# EAGLE design ATESLEME (EAGLE 9.6.2)

## Sheet 1 of 5
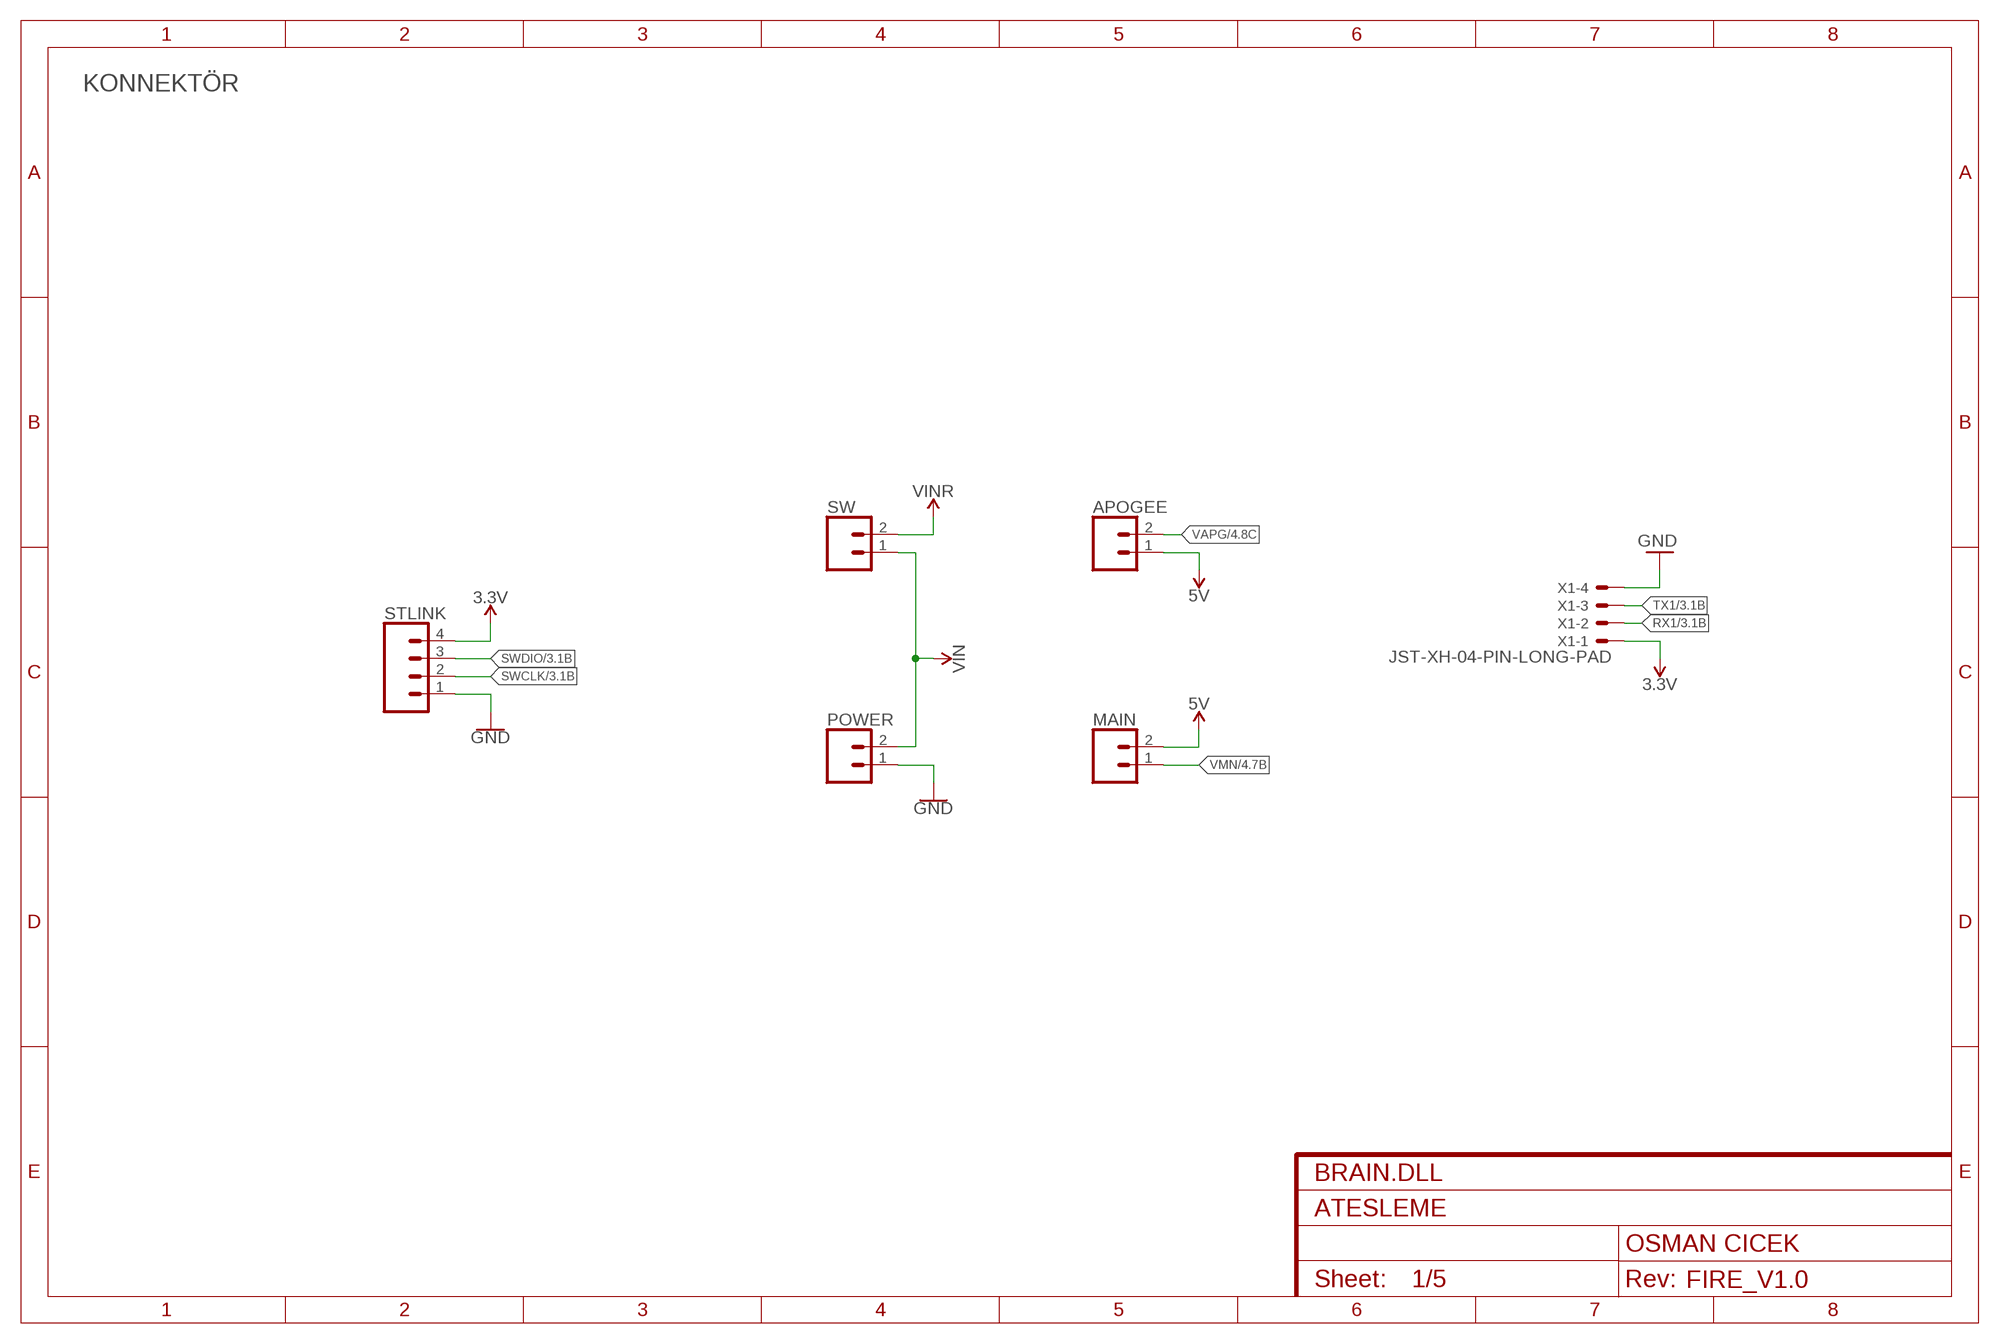
[diagram p0: schematic, sheet 1]
FRAME1 (FRAME-A4L): ATESLEME: PART1; CNAME: BRAIN.DLL; CREVISION: FIRE_V1.0; DESIGNER: OSMAN CICEK

### Parts
APOGEE  CONN_023.5MM-NO_SILK  [SCREWTERMINAL-3.5MM-2-NS]
MAIN  CONN_023.5MM-NO_SILK  [SCREWTERMINAL-3.5MM-2-NS]
POWER  CONN_023.5MM-NO_SILK  [SCREWTERMINAL-3.5MM-2-NS]
STLINK  CONN_04  [1X04]
SW  CONN_023.5MM-NO_SILK  [SCREWTERMINAL-3.5MM-2-NS]
X1  JST-XH-04-PIN-LONG-PAD  [JST-XH-04-PACKAGE-LONG-PAD]

### Nets
3.3V: STLINK.4 X1.1 ; also sheet 2,3,5
5V: APOGEE.1 MAIN.2 ; also sheet 2
GND: POWER.1 STLINK.1 X1.4 ; also sheet 2,3,4,5
RX1: X1.2 ; also sheet 3
SWCLK: STLINK.2 ; also sheet 3
SWDIO: STLINK.3 ; also sheet 3
TX1: X1.3 ; also sheet 3
VAPG: APOGEE.2 ; also sheet 4
VCC: POWER.2 SW.1 ; supply symbol labelled VIN
VIN: SW.2 ; supply symbol labelled VINR ; also sheet 2
VMN: MAIN.1 ; also sheet 4

### Notes on the sheet
- KONNEKTÖR

## Sheet 2 of 5
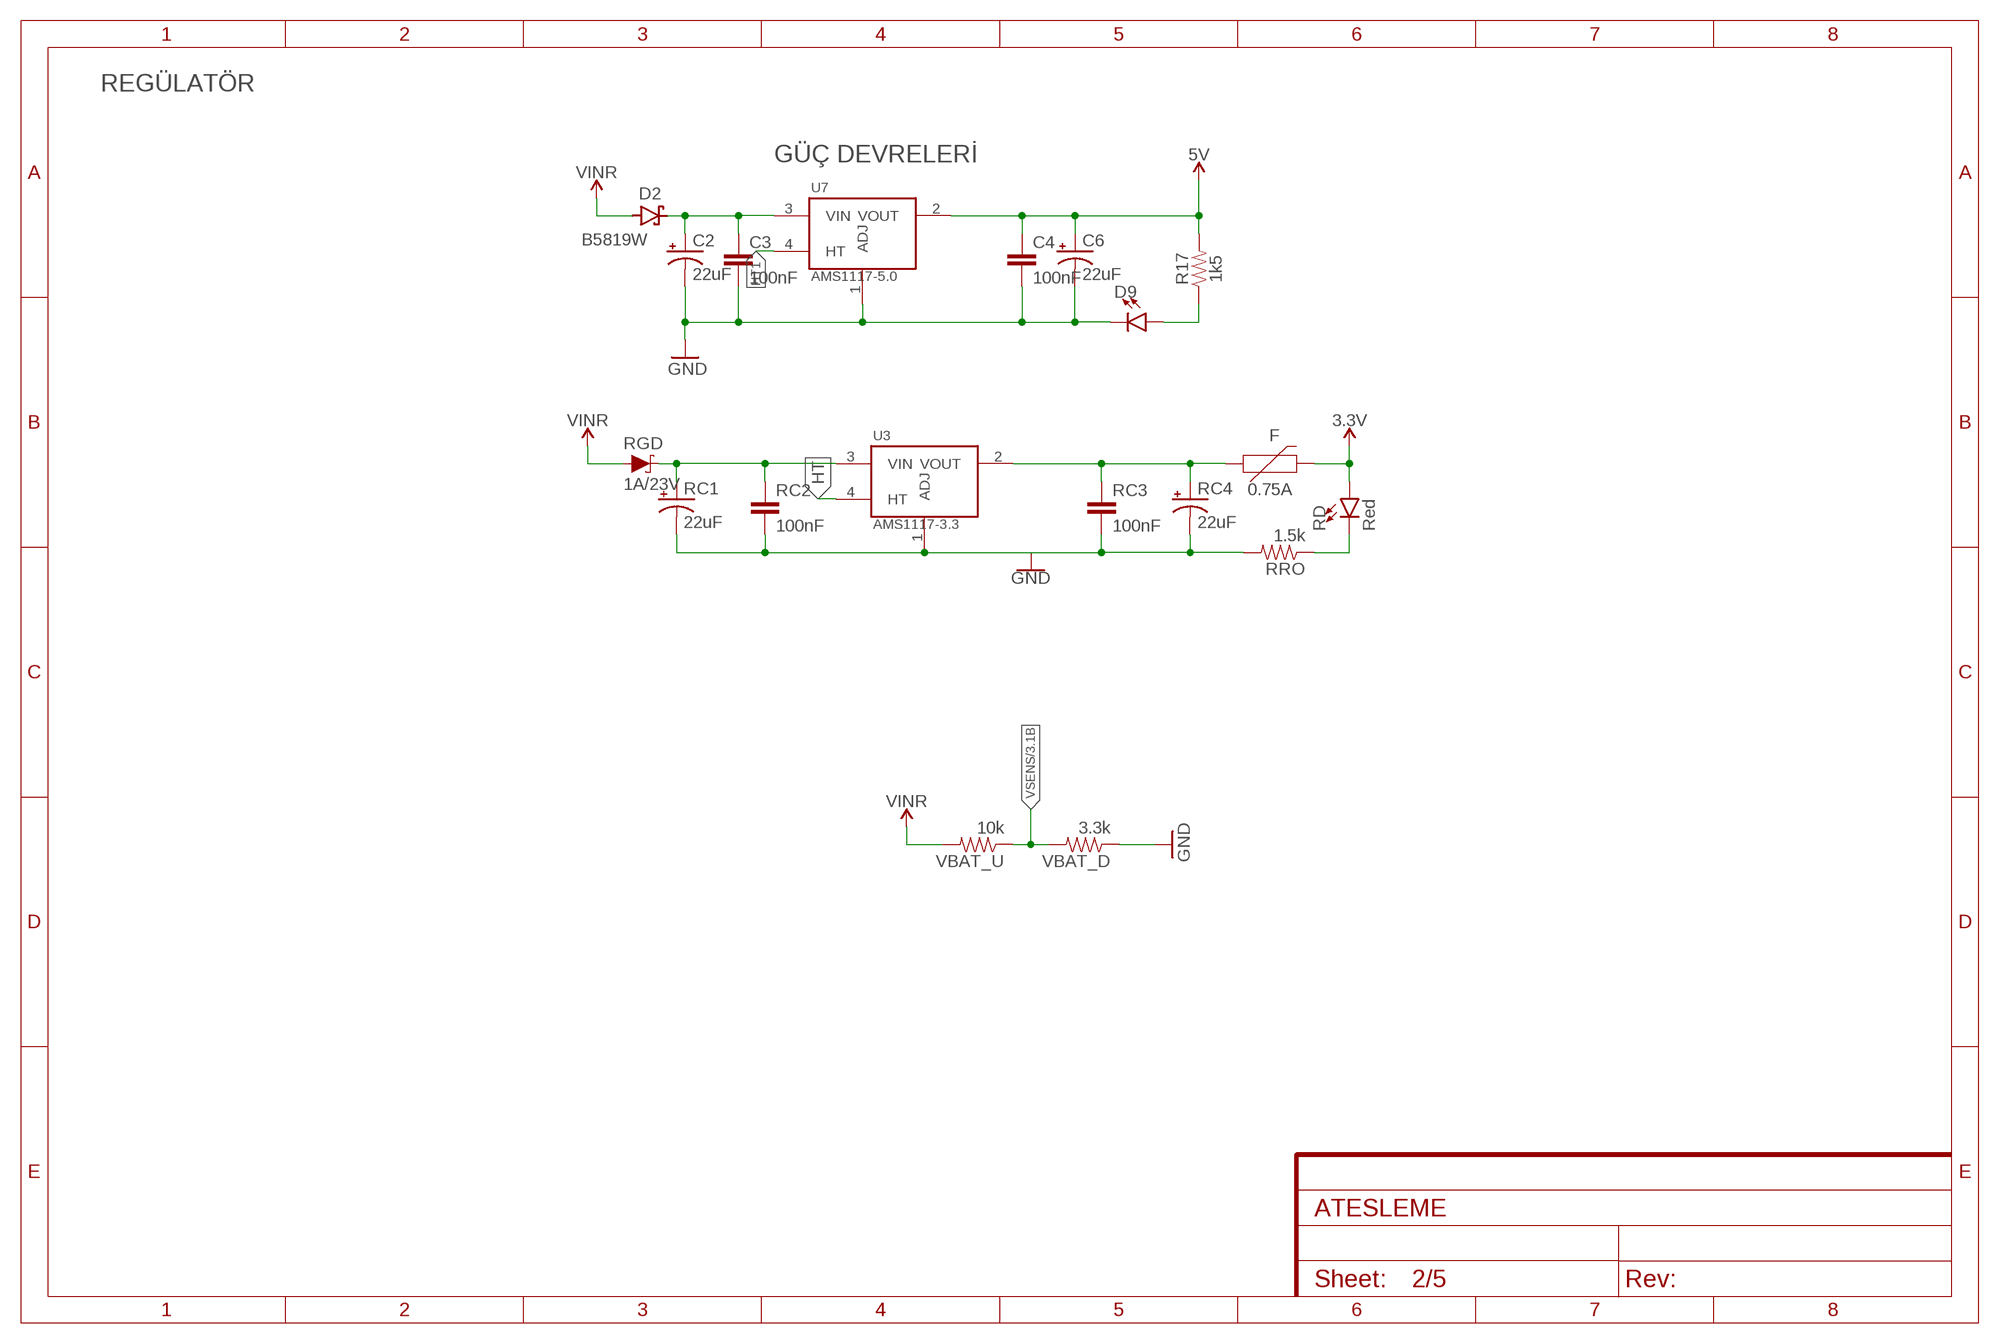
[diagram p1: schematic, sheet 2]

### Parts
C2  22uF  47UF-POLAR-EIA3528-10V-10%  [EIA3528]
C3  100nF  1.0UF-0603-16V-10%  [0603]
C4  100nF  1.0UF-0603-16V-10%  [0603]
C6  22uF  47UF-POLAR-EIA3528-10V-10%  [EIA3528]
D2  B5819W  SCHOTTKY_MBR0520LT1GDO-219  [SODFL3718X115]
D9  LED0603  [LED-0603]
F  0.75A  PPTC_THREE-QUARTER-AMP  [1206]
R17  1k5  1KOHM-0603-1/10W-1%  [0603]
RC1  22uF  10UF-POLAR-EIA3528-20V-10%(TANT)  [EIA3528]
RC2  100nF  0.1UF-0603-25V-(+80/-20%)  [0603]
RC3  100nF  0.1UF-0603-25V-(+80/-20%)  [0603]
RC4  22uF  10UF-POLAR-EIA3528-20V-10%(TANT)  [EIA3528]
RD  Red  LED-RED0603-SMART  [LED-0603]
RGD  1A/23V  DIODE-SCHOTTKY-BAT20J  [SOD-323]
RRO  1.5k  2.0KOHM1/10W5%(0603)  [0603-RES]
U3  AMS1117-3.3  [SOT229P700X180-4N]
U7  AMS1117-5.0  AMS1117-3.3  [SOT229P700X180-4N]
VBAT_D  3.3k  2.0KOHM1/10W5%(0603)  [0603-RES]
VBAT_U  10k  2.0KOHM1/10W5%(0603)  [0603-RES]

### Nets
3.3V: F.2 RD.A ; also sheet 1,3,5
5V: C4.1 C6.A(+) R17.2 U7.2(VOUT) ; also sheet 1
GND: C2.C(-) C3.2 C4.2 C6.C(-) D9.C RC1.C(-) RC2.2 RC3.2 RC4.C(-) RRO.2 U3.1(ADJ) U7.1(ADJ) VBAT_D.1 ; also sheet 1,3,4,5
HT: U3.4(HT)
HT1: U7.4(HT)
N$1: F.1 RC3.1 RC4.A(+) U3.2(VOUT)
N$2: RD.C RRO.1
N$4: C2.A(+) C3.1 D2.1(C) U7.3(VIN)
N$8: D9.A R17.1
VIN: D2.2(A) RGD.A VBAT_U.2 ; supply symbol labelled VINR ; also sheet 1
VNR: RC1.A(+) RC2.1 RGD.C U3.3(VIN)
VSENS: VBAT_D.2 VBAT_U.1 ; also sheet 3

### Notes on the sheet
- REGÜLATÖR
- GÜÇ DEVRELERİ

## Sheet 3 of 5
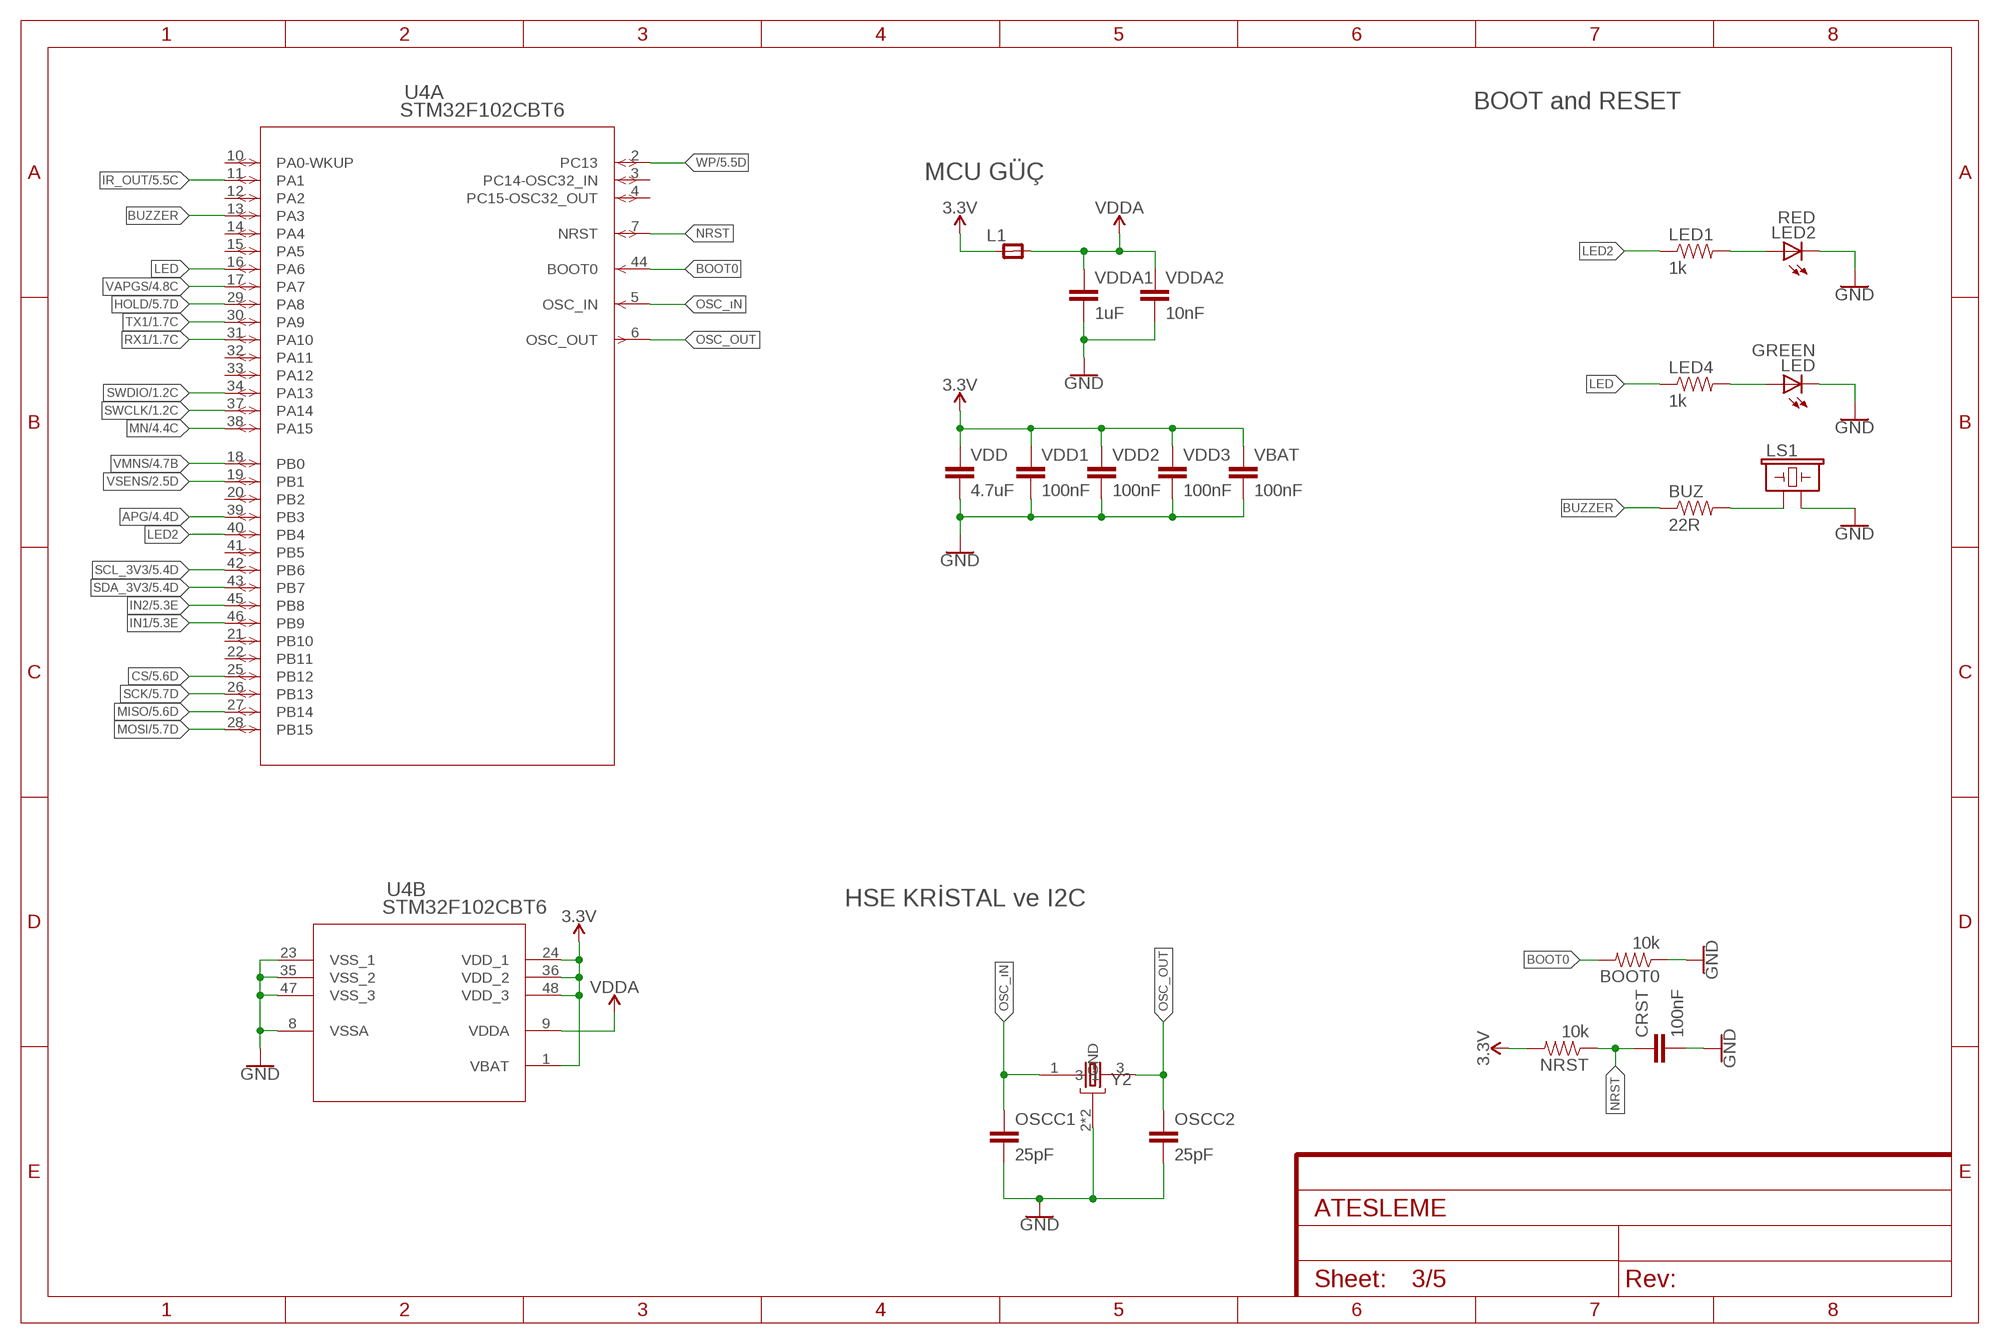
[diagram p2: schematic, sheet 3]

### Parts
BOOT0  10k  2.0KOHM1/10W5%(0603)  [0603-RES]
BUZ  22R  2.0KOHM1/10W5%(0603)  [0603-RES]
CRST  100nF  0.1UF-0603-25V-(+80/-20%)  [0603]
L1  RC-MASTER-SMD_FB_0805MP  [RC-MASTER-SMD_L0805MP]
LED  GREEN  LED-RED0603  [LED-0603]
LED1  1k  2.0KOHM1/10W5%(0603)  [0603-RES]
LED2  RED  LED-RED0603  [LED-0603]
LED4  1k  2.0KOHM1/10W5%(0603)  [0603-RES]
LS1  BUZZER-PTH  [BUZZER-12MM]
NRST  10k  2.0KOHM1/10W5%(0603)  [0603-RES]
OSCC1  25pF  0.1UF-0603-25V-(+80/-20%)  [0603]
OSCC2  25pF  0.1UF-0603-25V-(+80/-20%)  [0603]
U4  STM32F102CBT6  [LQFP48-7X7MM]
VBAT  100nF  0.1UF-0603-25V-(+80/-20%)  [0603]
VDD  4.7uF  0.1UF-0603-25V-(+80/-20%)  [0603]
VDD1  100nF  0.1UF-0603-25V-(+80/-20%)  [0603]
VDD2  100nF  0.1UF-0603-25V-(+80/-20%)  [0603]
VDD3  100nF  0.1UF-0603-25V-(+80/-20%)  [0603]
VDDA1  1uF  0.1UF-0603-25V-(+80/-20%)  [0603]
VDDA2  10nF  0.1UF-0603-25V-(+80/-20%)  [0603]
Y2  ABM2B-8.000MHZ-10-1-U-T  ABM3B-26.000MHZ-10-1-U-T  [OSCCC500X320X110-4N]

### Nets
3.3V: L1.1 NRST.2 U4.1(B:VBAT) U4.24(B:VDD_1) U4.36(B:VDD_2) U4.48(B:VDD_3) VBAT.1 VDD1.1 VDD2.1 VDD3.1 VDD.1 ; also sheet 1,2,5
APG: U4.39(A:PB3) ; also sheet 4
BOOT0: BOOT0.2 U4.44(A:BOOT0)
BUZZER: BUZ.1 U4.13(A:PA3)
CS: U4.25(A:PB12) ; also sheet 5
GND: BOOT0.1 CRST.2 LED2.C LED.C LS1.- OSCC1.2 OSCC2.2 U4.8(B:VSSA) U4.23(B:VSS_1) U4.35(B:VSS_2) U4.47(B:VSS_3) VBAT.2 VDD1.2 VDD2.2 VDD3.2 VDD.2 VDDA1.2 VDDA2.2 Y2.2(GND) Y2.4(GND) ; also sheet 1,2,4,5
HOLD: U4.29(A:PA8) ; also sheet 5
IN1: U4.46(A:PB9) ; also sheet 5
IN2: U4.45(A:PB8) ; also sheet 5
IR_OUT: U4.11(A:PA1) ; also sheet 5
LED: LED4.1 U4.16(A:PA6)
LED2: LED1.1 U4.40(A:PB4)
MISO: U4.27(A:PB14) ; also sheet 5
MN: U4.38(A:PA15) ; also sheet 4
MOSI: U4.28(A:PB15) ; also sheet 5
N$3: BUZ.2 LS1.+
N$6: LED1.2 LED2.A
N$10: LED4.2 LED.A
NRST: CRST.1 NRST.1 U4.7(A:NRST)
OSC_OUT: OSCC2.1 U4.6(A:OSC_OUT) Y2.3
OSC_ıN: OSCC1.1 U4.5(A:OSC_IN) Y2.1
RX1: U4.31(A:PA10) ; also sheet 1
SCK: U4.26(A:PB13) ; also sheet 5
SCL_3V3: U4.42(A:PB6) ; also sheet 5
SDA_3V3: U4.43(A:PB7) ; also sheet 5
SWCLK: U4.37(A:PA14) ; also sheet 1
SWDIO: U4.34(A:PA13) ; also sheet 1
TX1: U4.30(A:PA9) ; also sheet 1
VAPGS: U4.17(A:PA7) ; also sheet 4
VDDA: L1.2 U4.9(B:VDDA) VDDA1.1 VDDA2.1
VMNS: U4.18(A:PB0) ; also sheet 4
VSENS: U4.19(A:PB1) ; also sheet 2
WP: U4.2(A:PC13) ; also sheet 5
Unconnected: U4.3(A:PC14-OSC32_IN) U4.4(A:PC15-OSC32_OUT) U4.10(A:PA0-WKUP) U4.12(A:PA2) U4.14(A:PA4) U4.15(A:PA5) U4.20(A:PB2) U4.21(A:PB10) U4.22(A:PB11) U4.32(A:PA11) U4.33(A:PA12) U4.41(A:PB5)

### Notes on the sheet
- BOOT and RESET
- MCU GÜÇ
- HSE KRİSTAL ve I2C

## Sheet 4 of 5
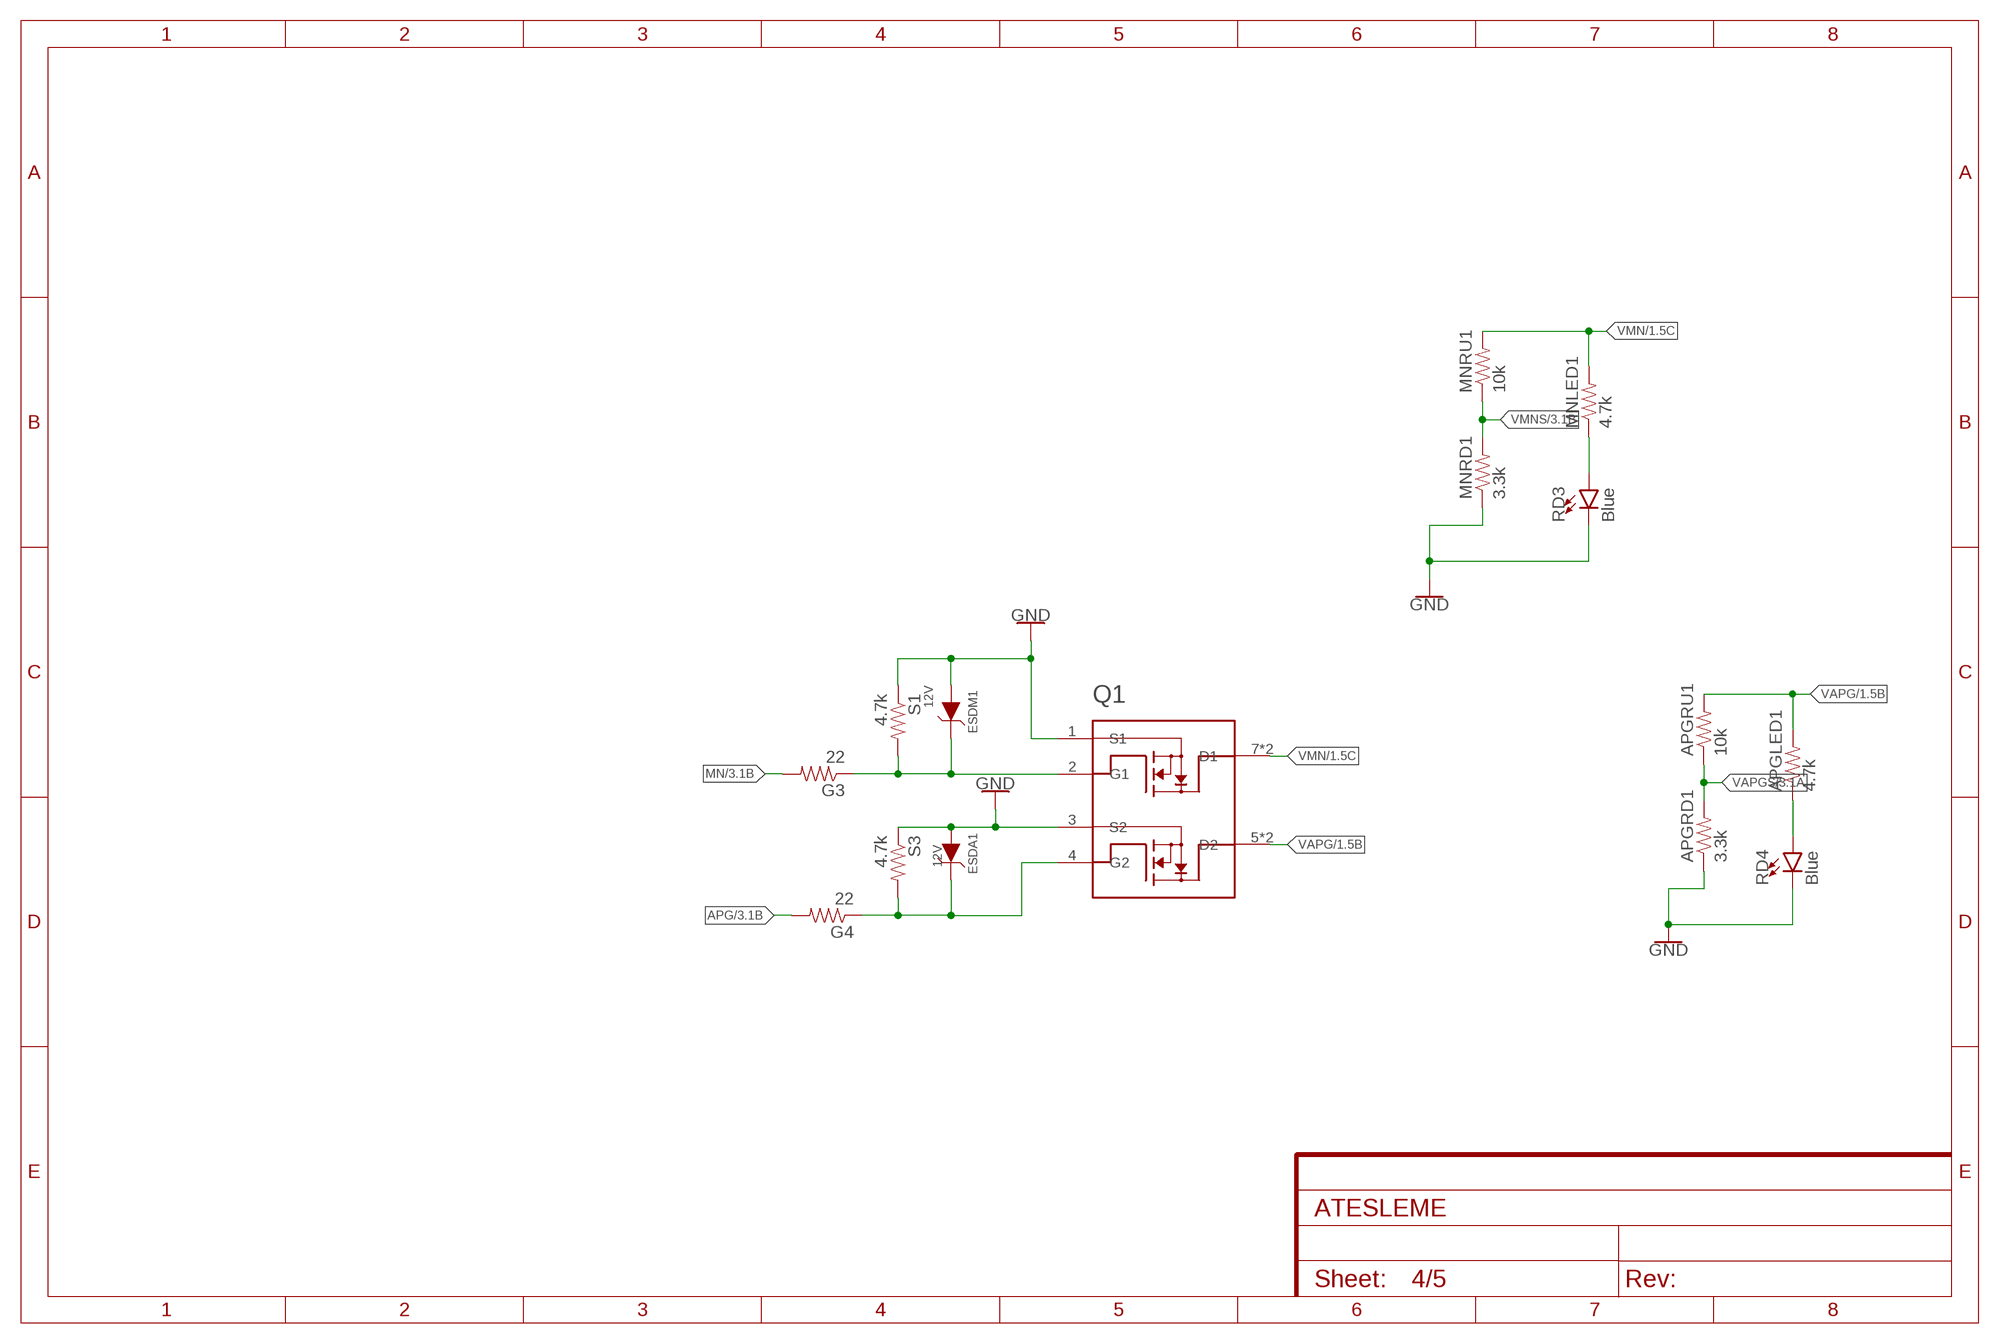
[diagram p3: schematic, sheet 4]

### Parts
APGLED1  4.7k  2.0KOHM1/10W5%(0603)  [0603-RES]
APGRD1  3.3k  2.0KOHM1/10W5%(0603)  [0603-RES]
APGRU1  10k  2.0KOHM1/10W5%(0603)  [0603-RES]
ESDA1  12V  WE-TVSP_DO-214AC_400W_UNI_824500102  [WE-TVSP_DO-214AC_UNIDIRECTIONAL]
ESDM1  12V  WE-TVSP_DO-214AC_400W_UNI_824500102  [WE-TVSP_DO-214AC_UNIDIRECTIONAL]
G3  22  2.0KOHM1/10W5%(0603)  [0603-RES]
G4  22  2.0KOHM1/10W5%(0603)  [0603-RES]
MNLED1  4.7k  2.0KOHM1/10W5%(0603)  [0603-RES]
MNRD1  3.3k  2.0KOHM1/10W5%(0603)  [0603-RES]
MNRU1  10k  2.0KOHM1/10W5%(0603)  [0603-RES]
Q1  STS4DNF60L  [SOIC127P600X175-8N]
RD3  Blue  LED-RED0603-SMART  [LED-0603]
RD4  Blue  LED-RED0603-SMART  [LED-0603]
S1  4.7k  2.0KOHM1/10W5%(0603)  [0603-RES]
S3  4.7k  2.0KOHM1/10W5%(0603)  [0603-RES]

### Nets
APG: G4.2 ; also sheet 3
GND: APGRD1.1 ESDA1.2(A) ESDM1.2(A) MNRD1.1 Q1.1(S1) Q1.3(S2) RD3.C RD4.C S1.1 S3.1 ; also sheet 1,2,3,5
MN: G3.2 ; also sheet 3
N$7: ESDM1.1(C) G3.1 Q1.2(G1) S1.2
N$9: MNLED1.1 RD3.A
N$11: ESDA1.1(C) G4.1 Q1.4(G2) S3.2
N$12: APGLED1.1 RD4.A
VAPG: APGLED1.2 APGRU1.2 Q1.5(D2) Q1.6(D2) ; also sheet 1
VAPGS: APGRD1.2 APGRU1.1 ; also sheet 3
VMN: MNLED1.2 MNRU1.2 Q1.7(D1) Q1.8(D1) ; also sheet 1
VMNS: MNRD1.2 MNRU1.1 ; also sheet 3

## Sheet 5 of 5
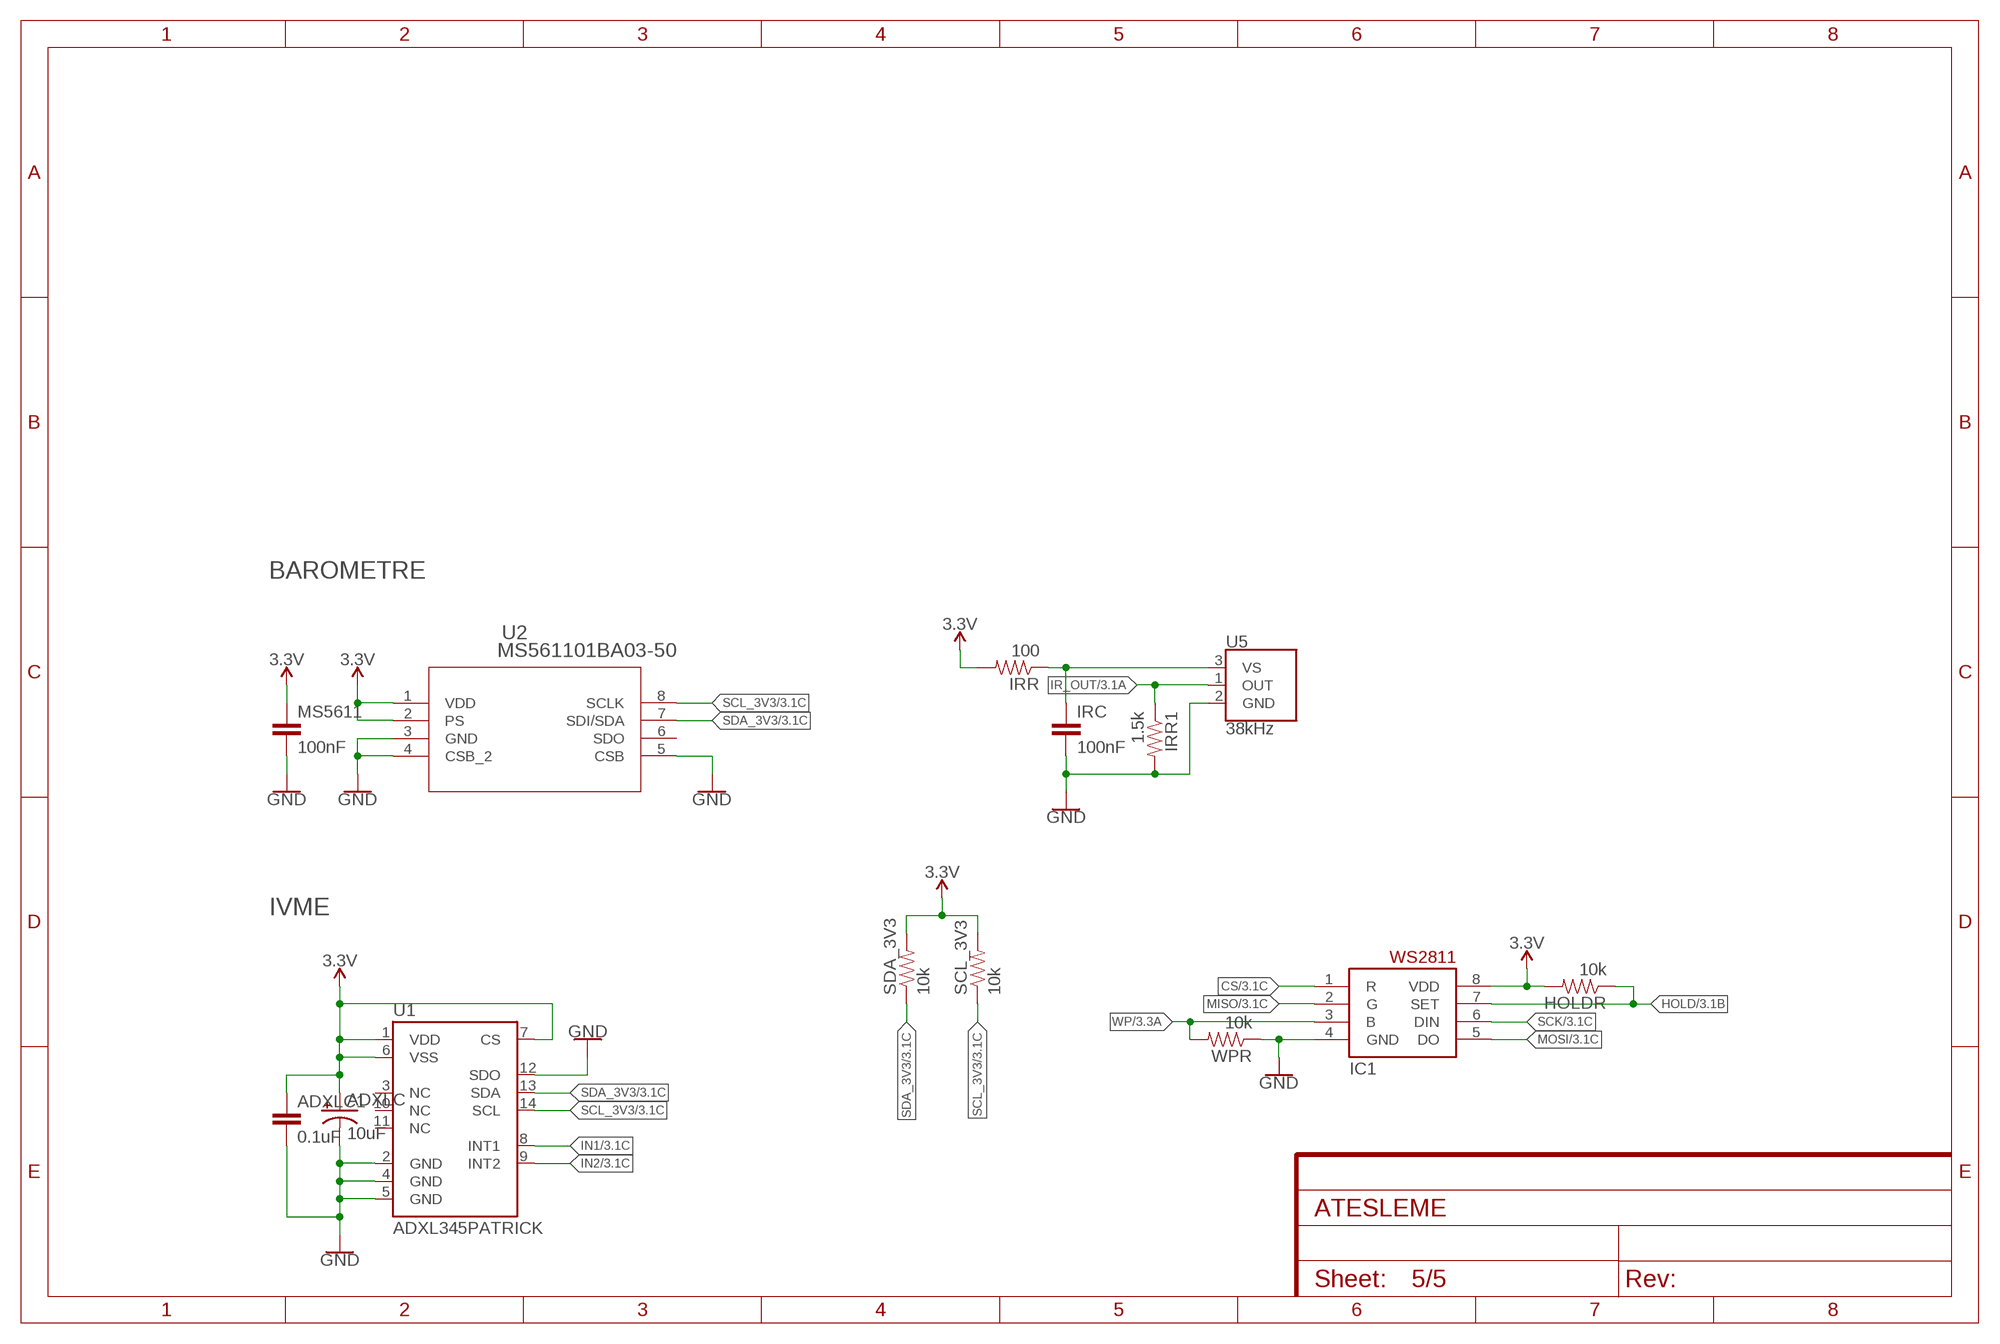
[diagram p4: schematic, sheet 5]

### Parts
ADXLC  10uF  10UF-POLAR-EIA3216-16V-10%(TANT)  [EIA3216]
ADXLC1  0.1uF  0.1UF-0603-25V-(+80/-20%)  [0603]
HOLDR  10k  2.0KOHM1/10W5%(0603)  [0603-RES]
IC1  EN25F40-100GCP-TR  WS2811-SOP8  [SO08-SKINNYPADS]
IRC  100nF  0.1UF-0603-25V-(+80/-20%)  [0603]
IRR  100  2.0KOHM1/10W5%(0603)  [0603-RES]
IRR1  1.5k  2.0KOHM1/10W5%(0603)  [0603-RES]
MS5611  100nF  0.1UF-0603-25V-(+80/-20%)  [0603]
SCL_3V3  10k  2.0KOHM1/10W5%(0603)  [0603-RES]
SDA_3V3  10k  2.0KOHM1/10W5%(0603)  [0603-RES]
U1  ADXL345PATRICK  [LGA14_1:1_PATRICK]
U2  MS561101BA03-50  [SON8_MS5611_TEC]
U5  38kHz  TSOP38238  [TSOP382]
WPR  10k  2.0KOHM1/10W5%(0603)  [0603-RES]

### Nets
3.3V: ADXLC1.1 ADXLC.+ HOLDR.2 IC1.8(VDD) IRR.2 MS5611.1 SCL_3V3.2 SDA_3V3.2 U1.1(VDD) U1.6(VSS) U1.7(CS) U2.1(VDD) U2.2(PS) ; also sheet 1,2,3
CS: IC1.1(R) ; also sheet 3
GND: ADXLC1.2 ADXLC.- IC1.4(GND) IRC.2 IRR1.2 MS5611.2 U1.2(GND) U1.4(GND) U1.5(GND) U1.12(SDO) U2.3(GND) U2.4(CSB_2) U2.5(CSB) U5.2(GND) WPR.1 ; also sheet 1,2,3,4
HOLD: HOLDR.1 IC1.7(SET) ; also sheet 3
IN1: U1.8(INT1) ; also sheet 3
IN2: U1.9(INT2) ; also sheet 3
IR_OUT: IRR1.1 U5.1(OUT) ; also sheet 3
MISO: IC1.2(G) ; also sheet 3
MOSI: IC1.5(DO) ; also sheet 3
N$5: IRC.1 IRR.1 U5.3(VS)
SCK: IC1.6(DIN) ; also sheet 3
SCL_3V3: SCL_3V3.1 U1.14(SCL) U2.8(SCLK) ; also sheet 3
SDA_3V3: SDA_3V3.1 U1.13(SDA) U2.7(SDI/SDA) ; also sheet 3
WP: IC1.3(B) WPR.2 ; also sheet 3
Unconnected: U1.3(NC) U1.10(NC) U1.11(NC) U2.6(SDO)

### Notes on the sheet
- BAROMETRE
- IVME

## Library data of the parts
ADXLC = SparkFun-Capacitors:10UF-POLAR: 10.0µF polarized capacitors A capacitor is a passive two-terminal electrical component used to store electrical energy temporarily in an electric field.; PROD_ID: CAP-00811
ADXLC1 = SparkFun-Capacitors:0.1UF: 0.1µF ceramic capacitors A capacitor is a passive two-terminal electrical component used to store electrical energy temporarily in an electric field.; PROD_ID: CAP-00810
APGLED1 APGRD1 APGRU1 BOOT0 BUZ G3 G4 HOLDR IRR IRR1 LED1 LED4 MNLED1 MNRD1 MNRU1 NRST RRO S1 S3 SCL_3V3 SDA_3V3 VBAT_D VBAT_U WPR = SparkFun-Resistors:2.0KOHM1/10W5%(0603): RES-08296; PROD_ID: RES-08296; VALUE: 2.0k
APOGEE MAIN POWER SW = SparkFun-Connectors:CONN_02: Multi connection point. Often used as Generic Header-pin footprint for 0.1 inch spaced/style header connections On any of the 0.1 inch spaced packages, you can populate with these: Break Away Headers - Straight <https://www.sparkfun.com/products/116> (PRT-00116) Break Away Male Headers - Right Angle <https://www.sparkfun.com/products/553> (PRT-00553) Female Headers <https://www.sparkfun.com/products/115> (PRT-00115) Break Away Headers - Machine Pin <https://www.sparkfun.com/products/117> (PRT-00117) Break Away Female Headers - Swiss Machine Pin <https://www.sparkfun.com/products/743> (PRT-00743) For SCREWTERMINALS and SPRING TERMINALS visit here: Screw Terimnals on SparkFun.com <https://www.sparkfun.com/search/results?term=Screw+Terminals> (5mm/3.5mm/2.54mm spacing) This device is also useful as a general connection point to wire up your design to another part of your project. Our various solder wires solder well into these plated through hole pads. Hook-Up Wire - Assortment (Stranded, 22 AWG) <https://www.sparkfun.com/products/11375> (PRT-11375) Hook-Up Wire - Assortment (Solid Core, 22 AWG) <https://www.sparkfun.com/products/11367> (PRT-11367) View the entire wire category on our website here <https://www.sparkfun.com/categories/141> Special notes: Molex polarized connector foot print use with: PRT-08233 with associated crimp pins and housings. 2.54_SCREWTERM for use with PRT-10571. 3.5mm Screw Terminal footprints for PRT-08084 5mm Screw Terminal footprints for use with PRT-08432; PROD_ID: CONN-08399
C2 C6 = SparkFun-Capacitors:47UF-POLAR: 47µF polarized capacitors A capacitor is a passive two-terminal electrical component used to store electrical energy temporarily in an electric field.; PROD_ID: CAP-08310; VALUE: 47uF
C3 C4 = SparkFun-Capacitors:1.0UF: 1µF ceramic capacitors A capacitor is a passive two-terminal electrical component used to store electrical energy temporarily in an electric field.; PROD_ID: CAP-00868; VALUE: 1.0uF
CRST IRC MS5611 OSCC1 OSCC2 RC2 RC3 VBAT VDD VDD1-VDD3 VDDA1 VDDA2 = SparkFun-Capacitors:0.1UF: 0.1µF ceramic capacitors A capacitor is a passive two-terminal electrical component used to store electrical energy temporarily in an electric field.; PROD_ID: CAP-00810; VALUE: 0.1uF
D2 = Diode:SCHOTTKY_: Schottky Diode - Popular parts; CATEGORY: Diode; DESCRIPTION: DIODE SCHOTTKY 20V 500MA SOD123; MANUFACTURER: ON Semiconductor; MPN: MBR0520LT1G; SUB-CATEGORY: Schottky; VALUE: MBR0520LT1G
D9 = SparkFun-LED:LED: LED (Generic) Standard schematic elements and footprints for 5mm, 3mm, 1206, and 0603 sized LEDs. Generic LEDs with no color specified.
ESDA1 ESDM1 = Wurth_EMC Components_WE-TVSP:WE-TVSP_DO-214AC_400W_UNI: WE-TVSP Power TVS Diode Characteristics Low Profile Package Glass passivated Juction Excellent clamping capability Fast response time MSL Level 1, per J-STD-020 Classification of the plastic case: UL 94 V-0 Safety certification UL 497B, E478010 Identical design: - DO-214AC = SMAJ - DO-214AA = SMBJ - DO-214AB = SMCJ/SMDJ Applications Ideal to protect the I/O Interfaces, Bus Voltage and other circuits of sensetive electronic equipment against voltage transiensts <https://www.we-online.com/catalog/media/o55793v209%20WE-TVSP_600W-3000W_D0214AA_4C.jpg> Details see: https://www.we-online.com/catalog/en/WE-TVSP/ Updated by Ella Wu 2020-07-20 2020 (C) Würth Elektronik; DATASHEET-URL: https://www.we-online.com/catalog/datasheet/824500102.pdf; IPEAK: 2.5A; MOUNT: SMT; PART-NUMBER: 824500102; PDISS: 400W; VALUE: 100V; VBR: 117V; VCLAMP: 162V
F = SparkFun-Fuses:PPTC: Resettable Fuse PPTC Resettable Fuse. Really a sort of resistor with a polymeric positive temperature coefficient whose resistance increases dramatically with an increase in temperature. When heated by the power passing through the resistance rises causing the current to be limited, protecting the circuit. This is achieved by the transition of the polymer from a crystalline to an amorphous state where the conductive carbon separates breaking the conductive pathways found in the cool crystalline structure. When a PPTC cools back down it resumes conducting letting the circuit turn back on. SparkFun Products: SparkFun RedBoard - Programmed with Arduino <https://www.sparkfun.com/products/12757> Pro Micro - 5V/16MHz <https://www.sparkfun.com/products/12640> Arduino Pro 328 - 5V/16MHz <https://www.sparkfun.com/products/10915> MP3 Trigger <https://www.sparkfun.com/products/13720>; PROD_ID: RES-11150; VALUE: 6V/0.75A
IC1 = adafruit:WS2811
L1 = 52101-101-REV-A_v16:RC-MASTER-SMD_FB_: FERRITE BEAD
LED = SparkFun-LED:LED-RED: Assorted Red LEDs LilyPad 1206- DIO-09912 1206- DIO-00809 0603- DIO-00819; PROD_ID: DIO-00819; VALUE: RED
LED2 = SparkFun-LED:LED-RED: Assorted Red LEDs LilyPad 1206- DIO-09912 1206- DIO-00809 0603- DIO-00819; PROD_ID: DIO-00819
LS1 = SparkFun-Electromechanical:BUZZER: Buzzer Small round buzzers that operate around the audible 2kHz range. You can use these as speakers to create simple music or user interfaces. Variant Overview: PTH - Mini Speaker - PC Mount 12mm 2.048kHz <https://www.sparkfun.com/products/7950> PTH_KIT - Mini Speaker - PC Mount 12mm 2.048kHz <https://www.sparkfun.com/products/7950> KIT simplifies soldering by adding stop mask to one side of the pads. PTH_NO_SILK - Mini Speaker - PC Mount 12mm 2.048kHz <https://www.sparkfun.com/products/7950> No silkscreen indicator of buzzer outline. PTH_KIT_NO_SILK - Mini Speaker - PC Mount 12mm 2.048kHz <https://www.sparkfun.com/products/7950> KIT package w/o silkscreen SMD - Buzzer Audio Magnetic (CCV-084B16) SMD buzzer used on, e.g. the LilyPad Buzzer <https://www.sparkfun.com/products/8463> and RFID USB Reader <https://www.sparkfun.com/products/9963>. SMD_KIT - Buzzer Audio Magnetic (CCV-084B16) SMD Buzzer with elongated pins to make soldering easier. Used on the SparkFun Simon Says - Surface Mount Soldering Kit <https://www.sparkfun.com/products/10935>.; PROD_ID: COMP-08253; SF_SKU: COM-07950
Q1 = STS4DNF60L:STS4DNF60L: STS4DNF60L Series 60 V 0.055 O 15 nC N-Channel STripFET Power Mosfet - SOIC-8 Check prices <https://pricing.snapeda.com/parts/STS4DNF60L/STMicroelectronics/view-part?ref=eda>; AVAILABILITY: In Stock; DESCRIPTION: Mosfet Array 2 N-Channel (Dual) 60V 4A 2W Surface Mount 8-SO; MF: STMicroelectronics; MP: STS4DNF60L; PACKAGE: SOIC-8 STMicroelectronics; PRICE: None
R17 = SparkFun-Resistors:1KOHM: 1kΩ resistor A resistor is a passive two-terminal electrical component that implements electrical resistance as a circuit element. Resistors act to reduce current flow, and, at the same time, act to lower voltage levels within circuits. - Wikipedia; PROD_ID: RES-07856; VALUE: 1k
RC1 RC4 = SparkFun-Capacitors:10UF-POLAR: 10.0µF polarized capacitors A capacitor is a passive two-terminal electrical component used to store electrical energy temporarily in an electric field.; PROD_ID: CAP-08063; VALUE: 10uF
RD = SparkFun-LED:LED-RED: Red SMD LED Used in manufacturing of most products at SparkFun Packages: 0603 - SMD 0603 package [Product Link] <http://docs.avagotech.com/docs/AV02-0551EN> 0603 SMART - SMD 0603 SMART package ( more efficient and expensive)[Product Link] <http://www.osram-os.com/Graphics/XPic2/00077099_0.pdf> 1206 - SMD1206 package [Product Link] <https://www.sparkfun.com/datasheets/DevTools/LilyPad/Q150OVS4.pdff> SparkFun Products: Pro Mini 328 -5V <https://www.sparkfun.com/products/821> RedBoard <https://www.sparkfun.com/products/12757> IOIO-OTG <https://www.sparkfun.com/products/13613>; PROD_ID: DIO-11154
RD3 RD4 = SparkFun-LED:LED-RED: Red SMD LED Used in manufacturing of most products at SparkFun Packages: 0603 - SMD 0603 package [Product Link] <http://docs.avagotech.com/docs/AV02-0551EN> 0603 SMART - SMD 0603 SMART package ( more efficient and expensive)[Product Link] <http://www.osram-os.com/Graphics/XPic2/00077099_0.pdf> 1206 - SMD1206 package [Product Link] <https://www.sparkfun.com/datasheets/DevTools/LilyPad/Q150OVS4.pdff> SparkFun Products: Pro Mini 328 -5V <https://www.sparkfun.com/products/821> RedBoard <https://www.sparkfun.com/products/12757> IOIO-OTG <https://www.sparkfun.com/products/13613>; PROD_ID: DIO-11154; VALUE: Red
RGD = SparkFun-DiscreteSemi:DIODE-SCHOTTKY: Schottky diode A Schottky diode is a semiconductor diode which has a low forward voltage drop and a very fast switching action.; PROD_ID: DIO-11623; VALUE: 1A/23V/620mV
STLINK = SparkFun-Connectors:CONN_04: Multi connection point. Often used as Generic Header-pin footprint for 0.1 inch spaced/style header connections On any of the 0.1 inch spaced packages, you can populate with these: Break Away Headers - Straight <https://www.sparkfun.com/products/116> (PRT-00116) Break Away Male Headers - Right Angle <https://www.sparkfun.com/products/553> (PRT-00553) Female Headers <https://www.sparkfun.com/products/115> (PRT-00115) Break Away Headers - Machine Pin <https://www.sparkfun.com/products/117> (PRT-00117) Break Away Female Headers - Swiss Machine Pin <https://www.sparkfun.com/products/743> (PRT-00743) For SCREWTERMINALS and SPRING TERMINALS visit here: Screw Terimnals on SparkFun.com <https://www.sparkfun.com/search/results?term=Screw+Terminals> (5mm/3.5mm/2.54mm spacing) This device is also useful as a general connection point to wire up your design to another part of your project. Our various solder wires solder well into these plated through hole pads. Hook-Up Wire - Assortment (Stranded, 22 AWG) <https://www.sparkfun.com/products/11375> (PRT-11375) Hook-Up Wire - Assortment (Solid Core, 22 AWG) <https://www.sparkfun.com/products/11367> (PRT-11367) View the entire wire category on our website here <https://www.sparkfun.com/categories/141> Special notes: Molex polarized connector foot print use with SKU : PRT-08231 with associated crimp pins and housings. 1MM SMD Version SKU: PRT-10208; PROD_ID: CONN-09696
U1 = Testing:ADXL345
U2 = MS5611:MS561101BA03-50; BUILT_BY: EMA_UL_Team; COPYRIGHT: Copyright (C) 2016 Accelerated Designs. All rights reserved; DESCRIPTION: MS5611 BAROMETRIC SENSOR CM T&R; MANUFACTURER_PART_NUMBER: MS561101BA03-50; OUTPUT-SPAN: 24 bit ADC; PACKAGE: Surface Mountable; PRODUCT_DESCRIPTION: MS5611 BAROMETRIC SENSOR CM T&R; PRODUCT_TYPE: -; SENSOR_TYPE: Digital Pressure and Altimeter Sensor Modules; SOURCELIBRARY: TE_Connectivity-2018-03-16; SUPPLY_VOLTAGE: 1.8  3.6; TE_PART_NUMBER: MS561101BA03-50; VENDOR: TE Connectivity
U3 U7 = AMS1117-3.3:AMS1117-3.3: Sot223/Pkg 1-Amp 3.3-Volt Low Drop Out Voltage Regulatator; AVAILABILITY: Unavailable; DESCRIPTION: Sot223/Pkg 1-Amp 3.3-Volt Low Drop Out Voltage Regulatator; MF: Advanced Monolithic Systems; MP: AMS1117-3.3; PACKAGE: SOT-89 ams; PRICE: None
U4 = STM32F102CBT6:STM32F102CBT6; BUILT_BY: EMA_UL_Team; COPYRIGHT: Copyright (C) 2018 Accelerated Designs. All rights reserved; MANUFACTURER_PART_NUMBER: STM32F102CBT6; SOURCELIBRARY: Updates_to_database_2020-10-19; VENDOR: STMicroelectronics
U5 = SparkFun-Sensors:TSOP382: Vishay Semiconductor TSOP32838 - 38kHz IR Receiver These products are miniaturized IR receiver modules for infrared remote control systems. A PIN diode and a preamplifier are assembled on a leadframe, the epoxy package contains an IR filter. The demodulated output signal can be directly connected to a microprocessor for decoding.; PROD_ID: SEN-14114
X1 = Rembrandt Electronics - JST XH Connectors v1-0:JST-XH-04-PIN: JST XH Connector 2 Pin Wire to board connector. Pitch: 2,54 mm, (0.100") Number of pins: 4 Created by Rembrandt Electronics www.rembrandtelectronics.com
Y2 = ABM3B-26.000MHZ-10-1-U-T:ABM3B-26.000MHZ-10-1-U-T: Ceramic SMD Crystal Check prices <https://pricing.snapeda.com/parts/ABM3B-26.000MHZ-10-1-U-T/Abracon/view-part?ref=eda>; AVAILABILITY: Good; DESCRIPTION: 26MHz ±10ppm Crystal 10pF 50 Ohms 4-SMD, No Lead; MF: Abracon; MP: ABM3B-26.000MHZ-10-1-U-T; PACKAGE: SMD-4 Abracon LLC; PRICE: None; PURCHASE-URL: https://pricing.snapeda.com/search/part/ABM3B-26.000MHZ-10-1-U-T/?ref=eda

## Board
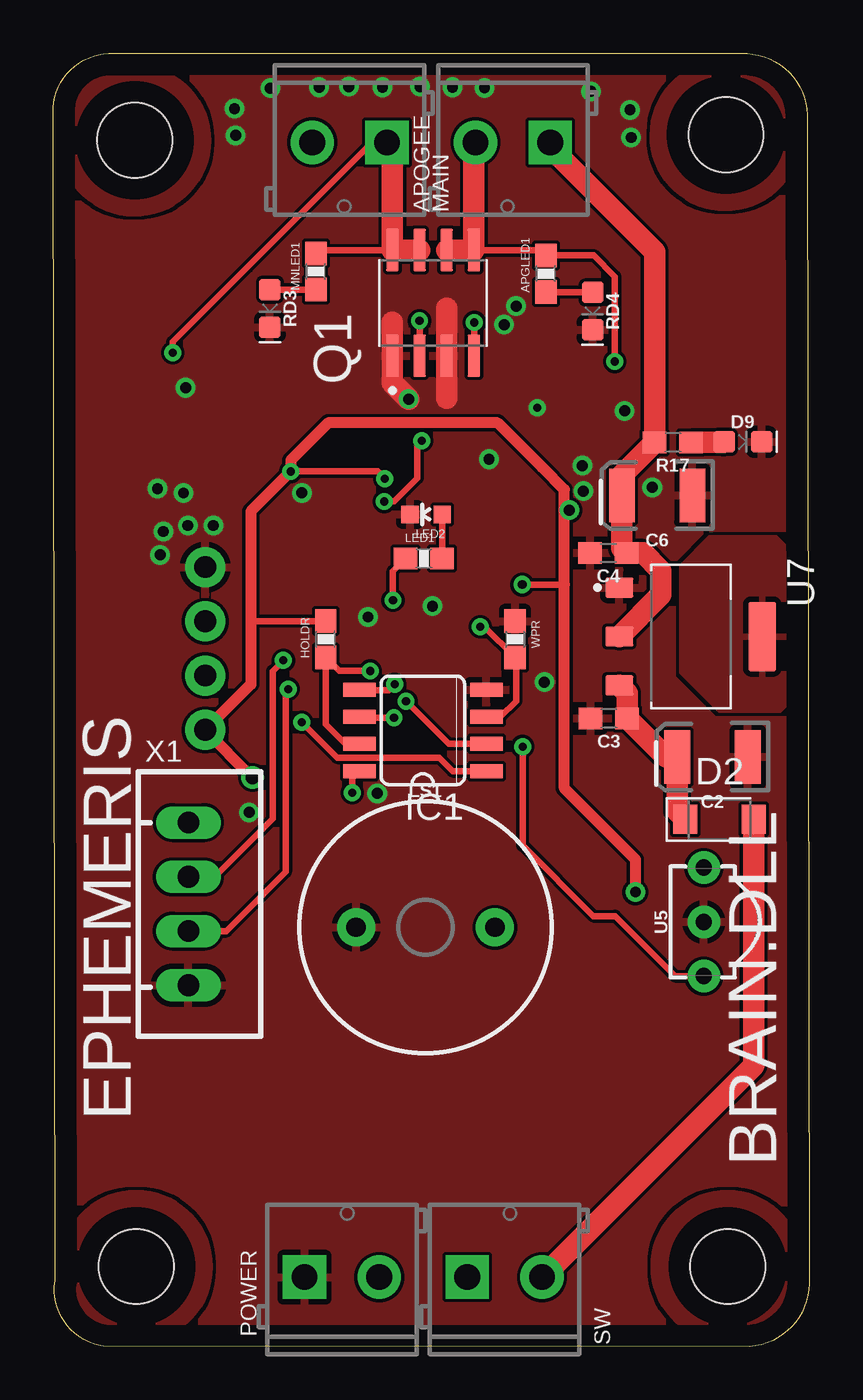
[diagram p5: board, top side]
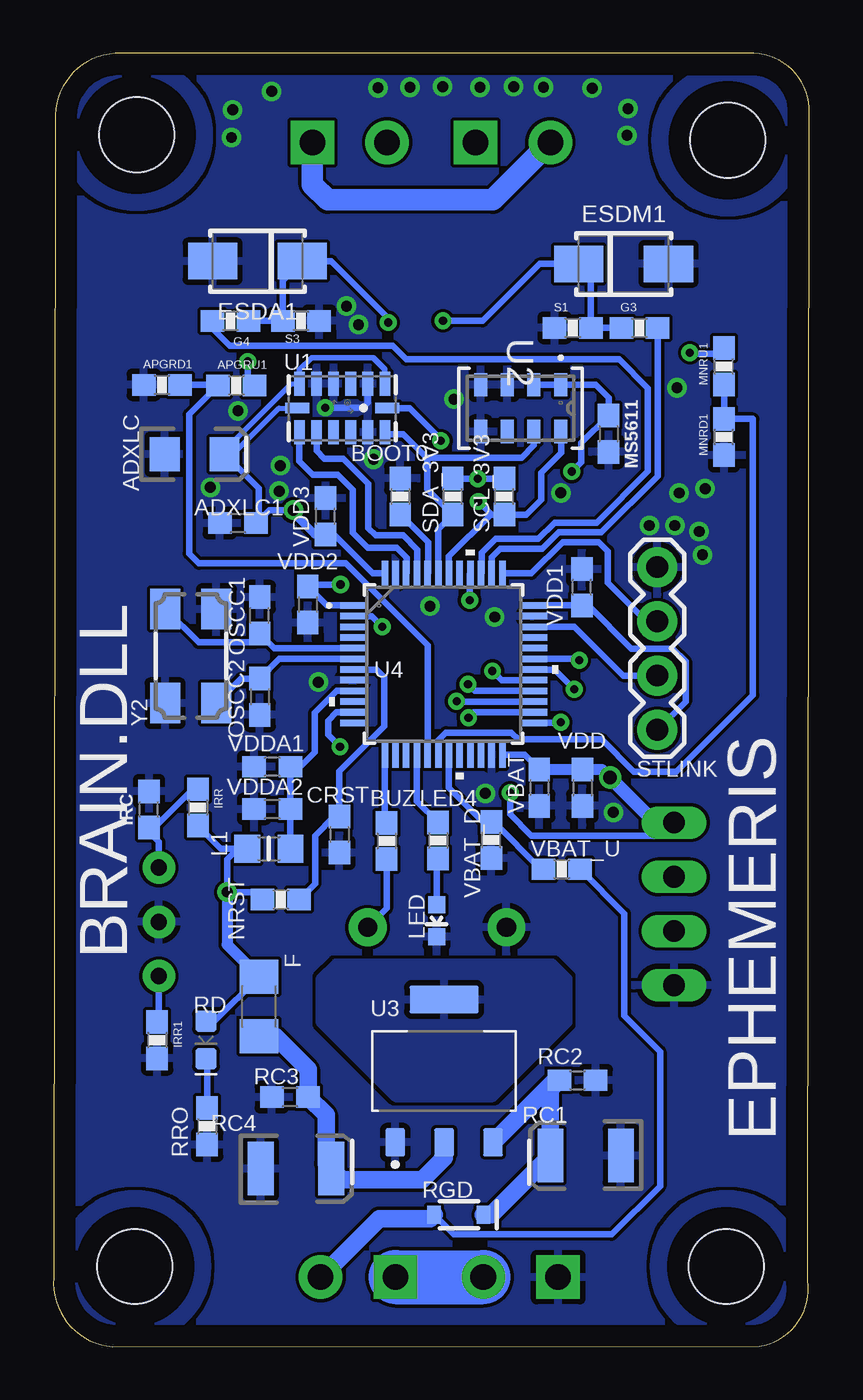
[diagram p6: board, bottom side, seen from below]

Size 35.39 x 60.55 mm. Coordinates in mm from the lower left corner, seen from the top.
Outline: 35.31,57.68 35.38,3.23 arc-90 32.61,0 2.34,0.03 arc-90 0.08,3.07 0,57.76 arc-90 2.59,60.55 32.21,60.55 arc-90 35.31,57.68
Copper layers (1*16): Top 0.035mm / dielectric 1.5mm / Bottom 0.035mm
Design rules "default": minimum track width 6mil, minimum drill 0.35mm, track to track 6mil, track to pad 6mil, pad to pad 6mil, via to via 6mil, smd to smd 6mil, copper to edge 40mil, drill to drill 6mil, minimum pad ring 10mil, minimum via ring 8mil, stop-mask expansion 4mil, vias tented up to drill 0mil, thermal gap 10mil
Holes 3.5 mm at 3.89,3.75 31.57,3.75 31.5,56.74 3.81,56.49

### Footprints (pad centres in the part's own frame; a part is rotated, then mirrored left to right if it is on the bottom)
EIA3216 = smd 1.4 x 1.6: + 1.4,0; - -1.4,0
0603 = smd 1.1 x 1: 1 -0.85,0; 2 0.85,0
0603-RES = smd 1.1 x 1: 1 -0.85,0; 2 0.85,0
SCREWTERMINAL-3.5MM-2-NS = drill 1.2 pad 2.032 square: 1 0,0 | drill 1.2 pad 2.032: 2 3.5,0
EIA3528 = smd 1.2 x 2.5: A 1.65,0; C -1.65,0
SODFL3718X115 = smd 1.115 x 1.361: 1 -1.6,0; 2 1.6,0
LED-0603 = smd 1 x 1: A -0.877,0; C 0.877,0
WE-TVSP_DO-214AC_UNIDIRECTIONAL = smd 2.3 x 1.7: 1 -2.1,0; 2 2.1,0
1206 = smd 1.6 x 1.8: 1 -1.4,0; 2 1.4,0
SO08-SKINNYPADS = smd 0.66 x 1.524: 1 -1.905,-2.973; 2 -0.635,-2.973; 3 0.635,-2.973; 4 1.905,-2.973; 5 1.905,2.973; 6 0.635,2.973; 7 -0.635,2.973; 8 -1.905,2.973
RC-MASTER-SMD_L0805MP = smd 1.2 x 1.3: 1 -1.016,0; 2 1.016,0
LED-0603' = smd 0.8 x 0.8: A 0,-0.75; C 0,0.75
BUZZER-12MM = drill 0.9 pad 1.778: + 3.25,0; - -3.25,0
SOIC127P600X175-8N = smd 1.97 x 0.58: 1 -2.475,1.905; 2 -2.475,0.635; 3 -2.475,-0.635; 4 -2.475,-1.905; 5 2.475,-1.905; 6 2.475,-0.635; 7 2.475,0.635; 8 2.475,1.905
SOD-323 = smd 0.63 x 0.83: A 1.15,0; C -1.15,0
1X04 = drill 1.016 pad 1.88: 1 0,0; 2 2.54,0; 3 5.08,0; 4 7.62,0
LGA14_1:1_PATRICK = smd 0.5 x 1.124: 1 2,1.138; 2 1.2,1.138; 3 0.4,1.138; 4 -0.4,1.138; 5 -1.2,1.138; 6 -2,1.138; 8 -2,-1.13; 9 -1.2,-1.138; 10 -0.4,-1.138; 11 0.4,-1.138; 12 1.2,-1.138; 13 2,-1.138 | smd 1.124 x 0.5: 7 -2.1,0; 14 2.1,0
SON8_MS5611_TEC = smd 1.092 x 0.61: 1 -1.1,1.875; 2 -1.1,0.625; 3 -1.1,-0.625; 4 -1.1,-1.875; 5 1.1,-1.875; 6 1.1,-0.625; 7 1.1,0.625; 8 1.1,1.875
SOT229P700X180-4N = smd 0.93 x 1.31: 1 -2.29,-3.345; 2 0,-3.345; 3 2.29,-3.345 | smd 3.24 x 1.31: 4 0,3.345
LQFP48-7X7MM = smd 1.194 x 0.305: 1 -4.25,2.75; 2 -4.25,2.25; 3 -4.25,1.75; 4 -4.25,1.25; 5 -4.25,0.75; 6 -4.25,0.25; 7 -4.25,-0.25; 8 -4.25,-0.75; 9 -4.25,-1.25; 10 -4.25,-1.75; 11 -4.25,-2.25; 12 -4.25,-2.75; 25 4.25,-2.75; 26 4.25,-2.25; 27 4.25,-1.75; 28 4.25,-1.25; 29 4.25,-0.75; 30 4.25,-0.25; 31 4.25,0.25; 32 4.25,0.75; 33 4.25,1.25; 34 4.25,1.75; 35 4.25,2.25; 36 4.25,2.75 | smd 0.305 x 1.194: 13 -2.75,-4.25; 14 -2.25,-4.25; 15 -1.75,-4.25; 16 -1.25,-4.25; 17 -0.75,-4.25; 18 -0.25,-4.25; 19 0.25,-4.25; 20 0.75,-4.25; 21 1.25,-4.25; 22 1.75,-4.25; 23 2.25,-4.25; 24 2.75,-4.25; 37 2.75,4.25; 38 2.25,4.25; 39 1.75,4.25; 40 1.25,4.25; 41 0.75,4.25; 42 0.25,4.25; 43 -0.25,4.25; 44 -0.75,4.25; 45 -1.25,4.25; 46 -1.75,4.25; 47 -2.25,4.25; 48 -2.75,4.25
TSOP382 = drill 0.762 pad 1.524: 1 -2.54,0; 2 0,0; 3 2.54,0
JST-XH-04-PACKAGE-LONG-PAD = drill 1.016 long: 1 -3.81,0; 2 -1.27,0; 3 1.27,0; 4 3.81,0
OSCCC500X320X110-4N = smd 1.9 x 1.4: 1 -2.2,-1.2; 2 2.2,-1.2; 3 2.2,1.2; 4 -2.2,1.2

### Placement (x,y rotation side)
ADXLC  28.78,41.78 0 bottom
ADXLC1  26.75,38.56 180 bottom
APGLED1  23.06,50.24 90 top
APGRD1  30.3,45.03 0 bottom
APGRU1  26.82,45.01 0 bottom
APOGEE  23.27,56.39 180 top
BOOT0  19.15,39.81 270 bottom
BUZ  19.79,23.67 270 bottom
C2  30.86,27.61 180 top
C3  26.01,29.41 180 top
C4  25.98,37.16 180 top
C6  28.27,39.85 180 top
CRST  22,23.98 270 bottom
D2  31.19,24.69 0 top
D9  32.28,42.37 0 top
ESDA1  25.83,50.83 180 bottom
ESDM1  8.69,50.7 0 bottom
F  25.76,15.93 90 bottom
G3  7.95,47.7 0 bottom
G4  27.1,48.03 180 bottom
HOLDR  12.75,33.12 90 top
IC1  17.3,28.85 90 top
IRC  30.91,25.15 90 bottom
IRR  28.63,25.25 270 bottom
IRR1  30.53,14.35 270 bottom
L1  25.3,23.32 0 bottom
LED  GREEN  [LED-0603']  17.45,19.94 180 bottom
LED1  17.35,36.91 0 top
LED2  RED  [LED-0603']  17.45,38.96 90 top
LED4  17.37,23.7 270 bottom
LS1  17.42,19.63 0 top
MAIN  15.62,56.39 180 top
MNLED1  12.29,50.34 90 top
MNRD1  3.99,42.6 90 bottom
MNRU1  3.99,45.9 90 bottom
MS5611  9.4,42.75 270 bottom
NRST  24.74,20.93 180 bottom
OSCC1  25.73,34.24 90 bottom
OSCC2  25.73,30.43 270 bottom
POWER  11.76,3.25 0 top
Q1  17.78,48.87 90 top
R17  29.01,42.34 180 top
RC1  10.46,8.94 180 bottom
RC2  10.85,12.47 0 bottom
RC3  24.31,11.68 180 bottom
RC4  24.03,8.33 0 bottom
RD  28.24,14.35 270 bottom
RD3  10.13,48.62 270 top
RD4  25.25,48.49 270 top
RGD  16.41,6.17 180 bottom
RRO  28.19,10.31 270 bottom
S1  11.07,47.7 0 bottom
S3  23.8,48.03 180 bottom
SCL_3V3  14.27,39.8 90 bottom
SDA_3V3  16.69,39.8 90 bottom
STLINK  7.11,36.5 270 bottom
SW  19.38,3.25 0 top
U1  21.87,43.94 0 bottom
U2  13.51,43.94 270 bottom
U3  17.09,12.9 0 bottom
U4  17.12,31.95 0 bottom
U5  30.45,19.89 90 top
U7  AMS1117-3.3  [SOT229P700X180-4N]  29.84,33.25 270 top
VBAT  12.64,26.17 270 bottom
VBAT_D  14.88,23.72 90 bottom
VBAT_U  11.58,22.35 0 bottom
VDD  10.62,26.17 270 bottom
VDD1  10.64,35.55 90 bottom
VDD2  23.48,34.75 270 bottom
VDD3  22.64,38.88 90 bottom
VDDA1  25.15,27.15 180 bottom
VDDA2  25.15,25.17 180 bottom
WPR  21.62,33.12 270 top
X1  6.32,20.73 270 top
Y2  28.96,32.33 270 bottom

### Tracks (layer width: path | path; a pad name or v marks a point on that pad's centre or on a via)
3.3V  (via drill 0.38, 0.41, 0.51, 0.64)
  Top 0.305: STLINK.4 7.11,28.85 | 23.93,35.68 v21.95,35.68 | v11.12,40.98 15.18,40.98 v15.52,40.64 | v14,25.93 14,26.62 IC1.8 | HOLDR.2 9.28,33.97 9.25,33.93
  Top 0.381: v24.16,39.17 23.98,39.34 23.98,40.13 22.94,41.17 22.89,41.17
  Top 0.508: v27.25,21.29 27.25,22.81 23.93,26.14 23.93,35.68 23.93,40.13 22.89,41.17 20.8,43.26 12.86,43.26 11.12,41.51 v11.12,40.98 9.25,39.11 9.25,33.93 9.25,31.01 STLINK.4 | v9.32,26.64 7.11,28.85
  Bottom 0.229: U1.7 24.84,43.94 27,41.78 ADXLC.+ 27.38,41.96 24.26,45.08 U1.6
  Bottom 0.254: U1.1 19.87,45.77 20.41,46.31 23.3,46.31 23.87,45.74 U1.6
  Bottom 0.305: F.2 27.85,15.23 RD.A | VDD3.1 22.26,38.03 20.43,36.2 U4.48 | STLINK.4 5.79,30.2 5.79,32.08 6.39,32.68 8.33,32.68 10.35,34.7 VDD1.1 U4.36 | VBAT.1 13.32,27.7 U4.24 | VDD.1 | v24.16,39.17 25.29,39.17 ADXLC1.1 25.78,38.68 25.78,40.18 ADXLC.+ | v21.95,35.68 23.4,35.68 VDD2.1 22.58,34.7 U4.1 | NRST.2 25.95,21.29 v27.25,21.29 27.25,22.81 26.75,23.32 L1.1 27.55,23.32 IRR.2 | U2.2 U2.1 10,45.04 9.4,44.44 MS5611.1 10.68,42.31 10.68,41.41 v11.12,40.98 | SCL_3V3.2 14.29,40.64 v15.52,40.64 16.68,40.64 SDA_3V3.2 | X1.1 6.93,23.93 13,23.93 14,24.92 v14,25.93
  Bottom 0.381: VDD3.1 23.15,38.03 24.16,39.03 v24.16,39.17
  Bottom 0.508: v27.25,21.29 27.25,18.82 F.2 | VDD.1 VBAT.1 | v9.32,26.64 9.7,27.02 VDD.1
  Bottom 0.635: v9.32,26.64 7.21,24.54 X1.1
5V
  Top 1.016: U7.2 28.45,35.2 28.45,36.32 27.61,37.16 C4.1 26.62,37.37 C6.A 26.62,40.81 R17.2 28.16,51.27 23.27,56.16 APOGEE.1
  Bottom 1.016: MAIN.2 14.81,53.7 22.56,53.7 23.27,54.41 APOGEE.1
APG
  Bottom 0.305: U4.39 15.33,36.25 15.33,37.16 14.67,37.82 12.68,37.82 11.92,38.59 9.96,38.59 7.56,40.99 7.56,44.88 8.9,46.23 18.87,46.23 19.51,46.86 27.13,46.86 27.95,47.69 G4.2
BOOT0
  Bottom 0.305: BOOT0.2 19.13,38.96 17.84,37.67 17.84,36.23 U4.44
BUZZER
  Bottom 0.305: U4.13 19.87,24.61 BUZ.1
CS  (via drill 0.38)
  Top 0.305: v11.63,29.24 13.28,27.58 18.06,27.58 18.69,26.95 IC1.1
  Bottom 0.305: U4.25 11.67,29.2 v11.63,29.24
D
  pour Bottom: 35,56.74 arc90 31.5,60.25 arc90 27.99,56.72 arc90 31.47,53.24 arc90
  pour Bottom: 7.32,56.49 arc90 3.78,59.99 arc90 0.3,56.46 arc90 3.81,52.98 arc90
  pour Bottom: 7.39,3.76 arc90 3.86,7.26 arc90 0.38,3.78 arc90 3.91,0.25 arc90
  pour Bottom: 35.08,3.76 arc90 31.57,7.26 arc90 28.07,3.76 arc90 31.57,0.25 arc90
  pour Top: 0.38,3.78 arc-90 3.86,7.26 3.89,7.26 arc-90 7.39,3.76 7.39,3.71 arc-90 3.94,0.25 3.91,0.25 arc-90
  pour Top: 28.03,3.75 arc-90 31.57,7.26 arc-90 35.05,3.73 arc-90 31.52,0.26 arc-90
  pour Top: 27.99,56.72 arc-90 31.52,60.25 arc-90 35,56.74 arc-90 31.45,53.24 arc-90
  pour Top: 0.3,56.51 arc-90 3.78,59.99 arc-90 7.32,56.46 arc-90 3.76,52.98 arc-90
GND  (via drill 0.38, 0.51)
  Top 1.016: 15.87,47.96 Q1.1 15.87,45.12 v16.63,44.36 | 18.41,44.4 Q1.3 18.41,48.62
  Bottom 0.305: U1.2 20.67,44.2 20.9,43.97 v22.66,43.97
  other vias: 11.63,39.98 20.4,41.55 17.75,34.67 14.73,34.16 24.82,40.06 20.19,58.94 18.69,58.97 17.17,58.99 15.41,58.97 13.84,58.99 12.44,58.97 26.75,43.81 15.16,25.91 22.99,31.11 9.17,25.02 4.87,40.17 6.29,38.45 5.15,38.17 7.49,38.45 6.19,44.9 5,37.07 6.09,39.97 28.04,40.23 24.76,41.25 25.17,58.78 10.16,58.93 27,57.91 27.05,56.62 8.48,57.96 8.53,56.72 21.67,48.72 21.11,47.85
  pour Bottom (rank 2): 35.56,60.93 35.56,-0.28 -0.48,-0.28 -0.48,60.93
  pour Top (rank 2): 35.69,61.01 35.69,-0.48 -0.58,-0.48 -0.58,61.01
HOLD  (via drill 0.38)
  Top 0.305: IC1.7 13.67,28.22 12.75,29.13 HOLDR.1 13.39,31.64 v14.83,31.64
  Bottom 0.305: U4.29 14.4,31.2 v14.83,31.64
HT
  pour Bottom: 19.38,11.63 14.81,11.63 11.25,15.19 11.25,17.22 12.01,17.98 22.17,17.98 22.94,17.22 22.94,15.19
HT1
  pour Top: 29.44,36.55 29.44,31.57 31.19,29.82 34.01,29.82 34.37,30.18 34.37,34.32 34.37,37.31 33.83,37.85 30.73,37.85
IN1
  Bottom 0.305: U1.8 23.87,41.45 23.24,40.82 22.07,40.82 21.38,40.13 21.38,38.11 20.68,37.41 19.31,37.41 18.85,36.94 18.85,36.23 U4.46
IN2
  Bottom 0.305: U1.9 23.07,41.94 22.7,41.57 21.81,41.57 20.64,40.39 20.64,38.32 20.3,37.99 19.01,37.99 18.34,37.32 18.34,36.23 U4.45
IR_OUT  (via drill 0.38)
  Top 0.305: v21.97,28.09 21.97,23.47 25.29,20.16 26.3,20.16 29.11,17.35 U5.1
  Bottom 0.305: v21.97,28.09 22.53,28.65 22.53,29.31 22.14,29.7 U4.11 | U5.1 30.45,15.28 IRR1.1
LED
  Bottom 0.305: U4.16 18.37,25.54 LED4.1
LED2  (via drill 0.38)
  Top 0.305: v15.9,34.95 15.9,36.31 LED1.1
  Bottom 0.305: U4.40 15.9,36.17 v15.9,34.95
MISO  (via drill 0.38)
  Top 0.305: v16.51,30.22 18.51,28.22 IC1.2
  Bottom 0.305: U4.27 16.5,30.2 v16.51,30.22
MN
  Bottom 0.305: G3.2 7.1,40.76 9.73,38.13 11.73,38.13 12.49,37.36 14.48,37.36 14.87,36.97 U4.38
MOSI  (via drill 0.38)
  Top 0.305: v15.98,31.01 15.7,30.73 14.35,30.73 IC1.5
  Bottom 0.305: U4.28 15.67,30.7 v15.98,31.01
N$1
  Bottom 0.813: F.1 25,14.53 23.46,12.98 RC3.1 22.62,10.85 22.62,8.57 RC4.A 21.87,7.82 18.11,7.82 17.09,8.84 U3.2
N$2
  Bottom 0.305: RD.C 28.19,13.42 RRO.1
N$3
  Bottom 0.305: BUZ.2 19.79,20.52 LS1.+
N$4
  Top 1.016: D2.1 29.21,25.07 C2.A 28.66,27.61 C3.1 26.86,30.6 U7.3
N$5
  Bottom 0.305: IRR.1 28.87,26.1 30.67,24.3 IRC.1 30.91,24.09 30.45,23.64 U5.3
N$6
  Top 0.305: LED2.A LED1.2
N$7  (via drill 0.38)
  Top 0.305: v17.14,48.03 Q1.2
  Bottom 0.305: G3.1 S1.2 10.22,50.14 ESDM1.1 12.62,50.7 15.29,48.03 v17.14,48.03
N$8
  Top 1.016: D9.A 31.38,42.34 R17.1
N$9
  Top 0.305: MNLED1.1 RD3.A | RD3.A
N$10
  Bottom 0.229: LED4.2 17.45,22.77
  Bottom 0.305: 17.45,22.77 LED.A
N$11  (via drill 0.38)
  Top 0.305: Q1.4 19.71,46.42 v19.71,47.96
  Bottom 0.305: v19.71,47.96 19.71,48.16 22.38,50.83 ESDA1.1 24.65,49.91 S3.2 G4.1
N$12
  Top 0.305: RD4.A 23.09,49.37 APGLED1.1
NRST
  Bottom 0.305: NRST.1 23.14,21.68 23.14,23.93 22.24,24.83 CRST.1 22,26.93 19.89,29.04 19.89,31.35 20.24,31.7 U4.7
OSC_OUT
  Bottom 0.305: Y2.3 26.61,31.28 OSCC2.1 24.81,32.2 U4.6
OSC_ıN
  Bottom 0.229: 25.63,33.29 OSCC1.1
  Bottom 0.305: Y2.1 28.59,32.97 25.96,32.97 25.63,33.29 25.04,32.7 U4.5
RX1  (via drill 0.38)
  Top 0.305: X1.2 7.54,22 10.26,24.71 10.26,31.62 v10.77,32.13
  Bottom 0.305: v10.77,32.13 10.84,32.2 U4.31
SCK  (via drill 0.38)
  Top 0.305: v15.95,29.45 14.36,29.45 IC1.6
  Bottom 0.305: U4.26 15.7,29.7 v15.95,29.45
SCL_3V3  (via drill 0.38)
  Top 0.305: v17.25,42.42 17.04,42.21 17.04,40.67 15.95,39.57 v15.49,39.57
  Bottom 0.305: SCL_3V3.1 14.92,38.95 16.87,37 U4.42 | U2.8 11.68,42.72 11.68,42.49 11.61,42.41 11.61,41.86 12.55,40.92 12.55,39.65 13.25,38.95 SCL_3V3.1 | U1.14 18.69,43.94 17.25,42.49 v17.25,42.42 | v15.49,39.57 14.87,38.95 SCL_3V3.1
SDA_3V3
  Bottom 0.305: U1.13 19.79,42.73 19,42.73 17.88,41.61 | U4.43 17.37,38.27 SDA_3V3.1 17.88,40.15 17.88,41.61 | U2.7 12.89,42.2 13.46,41.63 17.86,41.63 17.88,41.61
SWCLK
  Bottom 0.305: STLINK.2 7.62,33.96 9.43,35.76 9.43,37.25 9.86,37.67 11.54,37.67 13.01,36.2 U4.37
SWDIO
  Bottom 0.305: STLINK.3 8.71,31.42 11,33.7 U4.34
TX1  (via drill 0.38)
  Top 0.305: X1.3 8.1,19.46 10.87,22.23 10.87,30.66 v11,30.78
  Bottom 0.305: v11,30.78 11.92,31.7 U4.30
VAPG  (via drill 0.38)
  Top 0.305: APGLED1.2 23.09,51.09 | 23.09,51.09 25.3,51.09 26.29,50.1 v26.29,46.13 | Q1.5 22.84,51.34 23.09,51.09
  Top 1.016: APOGEE.2 19.68,56.31 Q1.5 Q1.6
  Bottom 0.305: v26.29,46.13 26.29,45.33 APGRU1.2
VAPGS
  Bottom 0.305: APGRD1.2 27.7,45.03 APGRU1.1 29.03,43.65 29.03,37.13 28.57,36.68 21.7,36.68 17.87,32.85 17.87,27.72 U4.17
VCC
  Bottom 2.54: SW.1 POWER.2
VDDA
  Bottom 0.229: 23.84,27.15 VDDA1.1 | L1.2 24.3,23.33
  Bottom 0.305: 23.84,27.15 23.15,27.84 23.15,29.67 22.12,30.7 U4.9 | VDDA1.1 VDDA2.1 24.3,23.33
VIN
  Top 1.016: SW.2 32.79,13.16 D2.2
  Bottom 0.305: VBAT_U.2 8.65,20.27 8.65,15.48 6.98,13.82 6.98,7.52 9.25,5.26 16.64,5.26 RGD.A
  Bottom 0.813: SW.2 20.14,5.99 17.74,5.99 RGD.A
VMN  (via drill 0.38)
  Top 0.305: MAIN.1 14.94,56.39 5.59,47.04 v5.59,46.53 | MNLED1.2 12.45,51.34 Q1.8
  Top 1.016: MAIN.1 15.87,56.13 Q1.8 Q1.7
  Bottom 0.305: v5.59,46.53 5.55,46.49 4.24,46.49 MNRU1.2
VMNS
  Bottom 0.305: U4.18 17.37,28.4 17.02,28.75 13.94,28.75 13.62,28.43 9.71,28.43 8.2,26.92 6.22,26.92 2.64,30.51 2.64,43.45 MNRD1.2 MNRU1.1
VNR
  Bottom 0.813: RGD.C 14.88,6.17 RC1.A 12.11,12.05 RC2.1 11.89,12.47 U3.3
VSENS
  Bottom 0.305: VBAT_U.1 12.56,22.35 14.78,24.57 VBAT_D.2 15.28,24.57 16.87,26.17 U4.19
WP  (via drill 0.38)
  Top 0.305: IC1.3 20.93,29.49 21.67,30.23 21.67,32.22 WPR.2 20.18,33.71 v19.99,33.71
  Bottom 0.305: v19.99,33.71 20.49,34.2 U4.2

### Text on the board
tPlace: BRAIN.DLL | EPHEMERIS
bPlace: BRAIN.DLL | EPHEMERIS